# Altium schematic sheet INTERFACE.SchDoc
size 594 x 419 mm
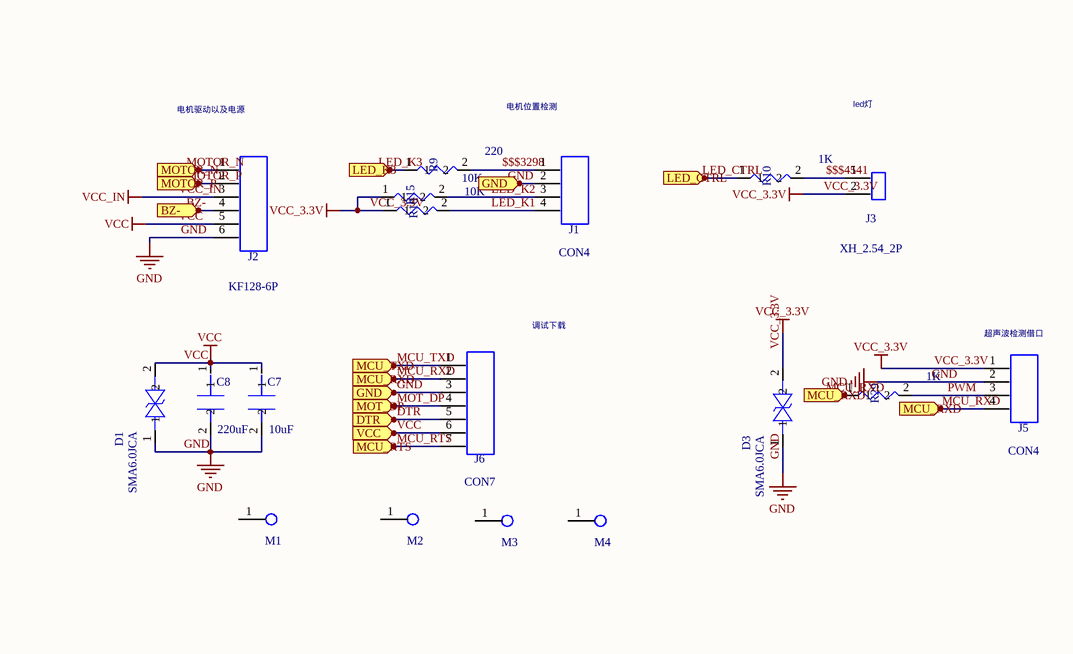
[diagram p0: INTERFACE.SchDoc, top left]
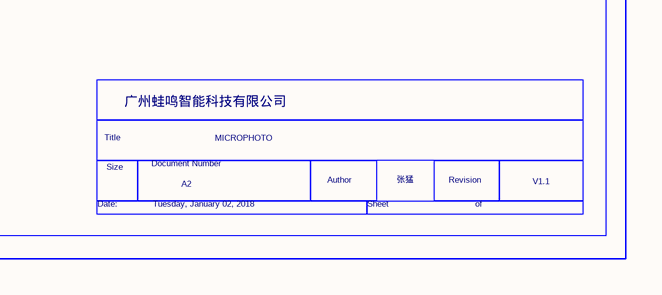
[diagram p1: INTERFACE.SchDoc, bottom right]

## Parts
C7  value 10uF  (hidden comment: CAP)
C8  value 220uF  (hidden comment: CAP)
D1  value SMA6.0JCA  (hidden comment: DIODE_BI_DIR_TRIG)
D3  value SMA6.0JCA  (hidden comment: DIODE_BI_DIR_TRIG)
J1  CON4
J2  KF128-6P
J3  XH_2.54_2P
J5  CON4
J6  CON7
M1  M2  (value not drawn)
M2  M2  (value not drawn)
M3  M2  (value not drawn)
M4  M2  (value not drawn)
R9  value 220  (hidden comment: RESISTOR)
R10  value 1K  (hidden comment: RESISTOR)
R15  value 10K  (hidden comment: RESISTOR)
R16  value 10K  (hidden comment: RESISTOR)
R29  value 1K  (hidden comment: RESISTOR)

## Ports
BZ-, DTR, GND, LED_CTRL, LED_K3, MCU_RTS, MCU_RXD, MCU_TXD, MOT_DP, MOTOR_N, MOTOR_P, VCC

## Nets
GND: C7.2 C8.2 D1.1 D3.1 J1.2 J2.6 J5.2 J6.3 ; port GND
VCC: C7.1 C8.1 D1.2 J2.5 J6.6 ; port VCC
VCC_3.3V: D3.2 J3.2 J5.1 R15.1 R16.1
VCC_IN: J2.3
$$$3298: J1.1 R9.2
$$$4541: J3.1 R10.2
BZ-: J2.4 ; port BZ-
DTR: J6.5 ; port DTR
LED_CTRL: R10.1 ; port LED_CTRL
LED_K1: J1.4 R16.2
LED_K2: J1.3 R15.2
LED_K3: R9.1 ; port LED_K3
MCU_RTS: J6.7 ; port MCU_RTS
MCU_RXD: J5.4 J6.2 R29.1 ; port MCU_RXD
MCU_TXD: J6.1 ; port MCU_TXD
MOT_DP: J6.4 ; port MOT_DP
MOTOR_N: J2.1 ; port MOTOR_N
MOTOR_P: J2.2 ; port MOTOR_P
PWM: J5.3 R29.2

Not connected (* = marked no-connect by the designer): M1 1; M2 1; M3 1; M4 1

## Notes on the sheet
- led灯
- 电机驱动以及电源
- 电机位置检测
- 调试下载
- (near J5) 超声波检测借口
- 广州蛙鸣智能科技有限公司
- Title
- Size
- Document Number
- MICROPHOTO
- Date:
- Tuesday, January 02, 2018
- A2
- Author
- Sheet
- 张猛
- Revision
- of
- V1.1

## Library data of the parts
C7 = CAP: Source_Path: E:\PROJECT\BGA441\MAINCHIP_DDR2_DDR3_V1.0.DSN; PAGE: 2; PCB DECAL: C0603
C8 = CAP: Source_Path: E:\PROJECT\BGA441\MAINCHIP_DDR2_DDR3_V1.0.DSN; PAGE: 2; PCB DECAL: C1206
D1 D3 = DIODE_BI_DIR_TRIG: Part_Type: ESD_TVS; Source_Path: Z:\RK_STANDARD_LIBRARY\CADENCE_CIS\RK_DISCRETE.OLB; RK_PN: ESD9B5V; Priority: A; Created_by: JJJ; PCB DECAL: SMA; Manufacturer_PN: ESD9B5V
J1 J5 = CON4: PCB DECAL: XH_2.54_4P
J6 = CON7: PCB DECAL: CON7P
R9 R10 R15 R16 R29 = RESISTOR: RES,thick film,47KOhm,+/-5%,1/16W,SMD0402; Source_Path: E:\COMPANY\ORCAD\RK2908\7_PMU\DS722_RK2918_ONE0907.DSN; PCB DECAL: ER0603
J2 = KF128-6P: PCB DECAL: KF128-6P
J3 = XH_2.54_2P: PCB DECAL: XH_2.54_2P
M1-M4 = M2: PCB DECAL: M2